# Altium project MB1397.PrjPcb (part 2 of 9)

## Sheet Audio.SchDoc: Audio
size A4; Date: Not used; ApprovedBy: Not used; CheckedBy: Not used; Author: Not used; CompanyName: STMicroelectronics; DrawnBy: Not used; Engineer: Not used; Organization: Not used; Address1: Not used; Address2: Not used; Address3: Not used; Address4: Not used; DocumentNumber: Not used; Revision: Not used; SheetNumber: 9; SheetTotal: 22; CurrentTime: Not used; CurrentDate: Not used; Time: Not used; DocumentFullPathAndName: Not used; DocumentName: Not used; ModifiedDate: Not used; ImagePath: Not used; ProjectName: Not used; Application_BuildNumber: Not used
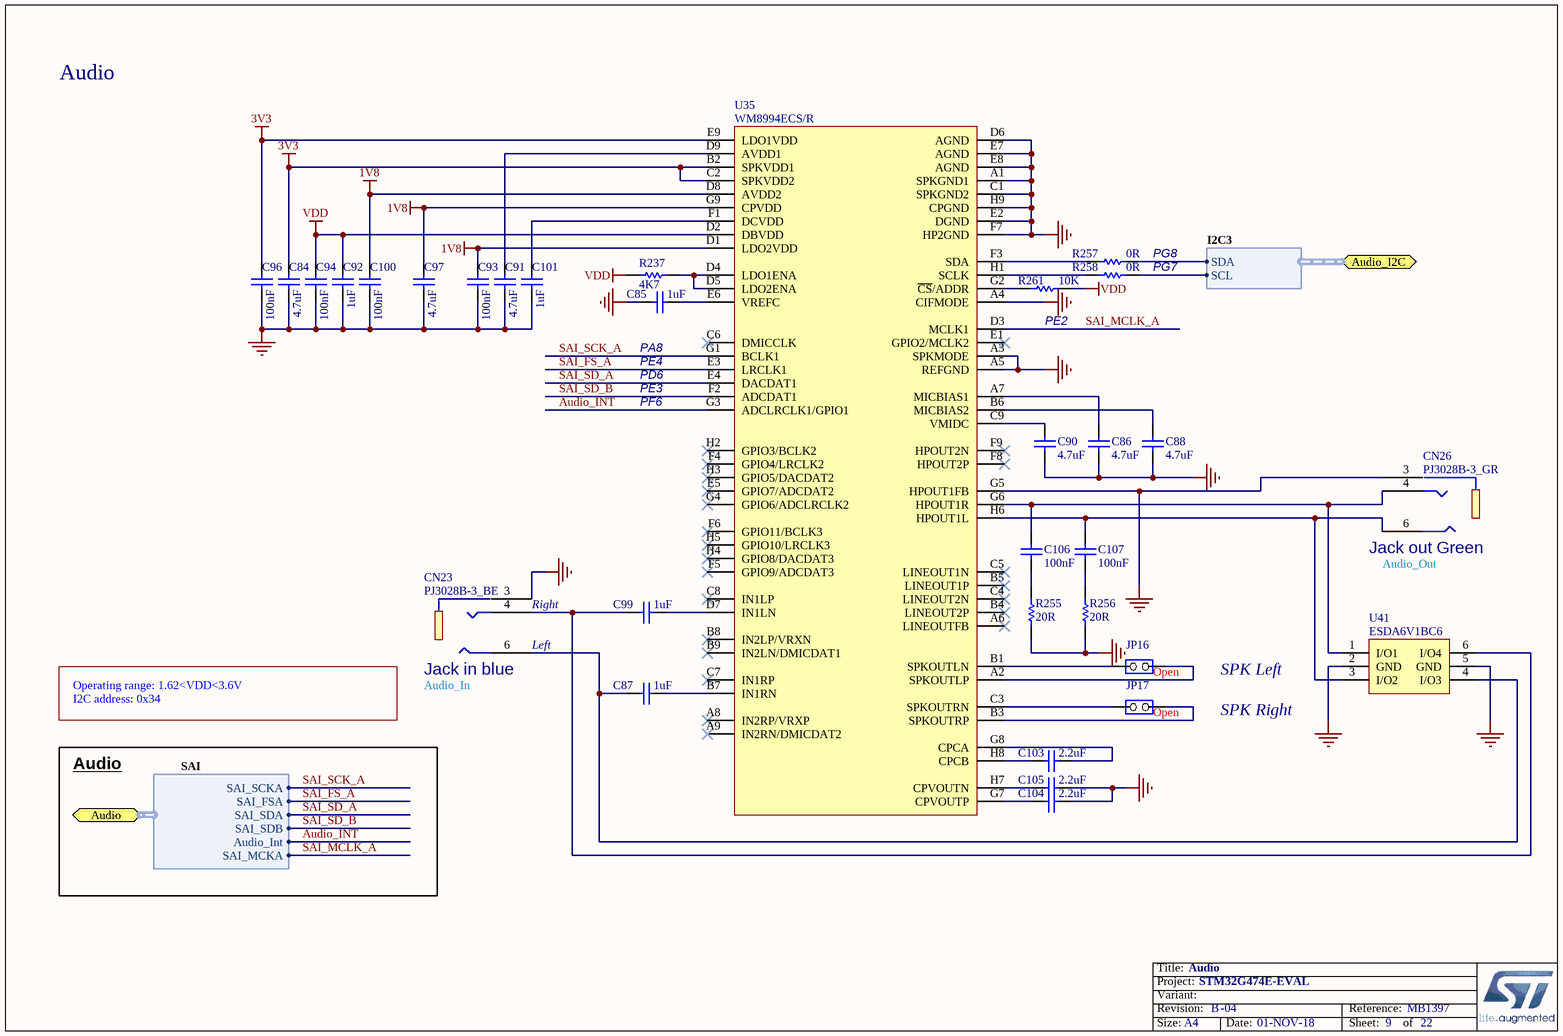
[diagram p4: Audio.SchDoc]

### Parts
C84  value 4.7uF  [C0603]  (hidden comment: Capacitor)
C85  value 1uF  [C0603]  (hidden comment: Capacitor)
C86  value 4.7uF  [C0603]  (hidden comment: Capacitor)
C87  value 1uF  [C0603]  (hidden comment: Capacitor)
C88  value 4.7uF  [C0603]  (hidden comment: Capacitor)
C90  value 4.7uF  [C0603]  (hidden comment: Capacitor)
C91  value 4.7uF  [C0603]  (hidden comment: Capacitor)
C92  value 1uF  [C0603]  (hidden comment: Capacitor)
C93  value 100nF  [C0402]  (hidden comment: Capacitor)
C94  value 100nF  [C0402]  (hidden comment: Capacitor)
C96  value 100nF  [C0402]  (hidden comment: Capacitor)
C97  value 4.7uF  [C0603]  (hidden comment: Capacitor)
C99  value 1uF  [C0603]  (hidden comment: Capacitor)
C100  value 100nF  [C0402]  (hidden comment: Capacitor)
C101  value 1uF  [C0603]  (hidden comment: Capacitor)
C103  value 2.2uF  [C0603]  (hidden comment: Capacitor)
C104  value 2.2uF  [C0603]  (hidden comment: Capacitor)
C105  value 2.2uF  [C0603]  (hidden comment: Capacitor)
C106  value 100nF  [C0402]  (hidden comment: Capacitor)
C107  value 100nF  [C0402]  (hidden comment: Capacitor)
CN23  value PJ3028B-3_BE  [CON_PHONE-JACK-3P5_HY_PJ3028B]  (hidden comment: Jack_PJ3028B-3_3P)
CN26  value PJ3028B-3_GR  [CON_PHONE-JACK-3P5_HY_PJ3028B]  (hidden comment: Jack_PJ3028B-3_3P)
JP16  Jumper_Header 2x1  [CON_SAMTEC_TSW-102-07-G-S]  (value not drawn)
JP17  Jumper_Header 2x1  [CON_SAMTEC_TSW-102-07-G-S]  (value not drawn)
R237  value 4K7  [R0402]  (hidden comment: Resistor)
R255  value 20R  [R0603]  (hidden comment: Resistor)
R256  value 20R  [R0603]  (hidden comment: Resistor)
R257  value 0R  [R0603]  (hidden comment: Resistor)
R258  value 0R  [R0603]  (hidden comment: Resistor)
R261  value 10K  [R0402]  (hidden comment: Resistor)
U35  WM8994ECS/R  [ICC_W-CSP-BGA72_4P511X4P023_P050]
U41  ESDA6V1BC6  [ESD_SOT23-6L]

### Ports
Audio (harness SAI), Audio_I2C (harness I2C3)

### Harnesses
I2C3: SDA, SCL
SAI: SAI_SDB, SAI_FSA, Audio_Int, SAI_SDA, SAI_SCKA, SAI_MCKA

### Nets
1V8: C93.1 C97.2 C100.1 U35.D1(LDO2VDD) U35.D8(AVDD2) U35.G9(CPVDD)
3V3: C84.2 C96.1 U35.B2(SPKVDD1) U35.C2(SPKVDD2) U35.E9(LDO1VDD)
GND: C84.1 C85.2 C86.1 C88.1 C90.1 C91.1 C92.1 C93.2 C94.2 C96.2 C97.1 C100.2 C101.1 C104.1 C105.1 CN23.3 CN26.3 R255.1 R256.1 U35.A1(SPKGND1) U35.A3(SPKMODE) U35.A4(CIFMODE) U35.A5(REFGND) U35.C1(SPKGND2) U35.D6(AGND) U35.E2(DGND) U35.E7(AGND) U35.E8(AGND) U35.F7(HP2GND) U35.G5(HPOUT1FB) U35.H9(CPGND) U41.2(GND) U41.5(GND)
VDD: C92.2 C94.1 R237.1 R261.1 U35.D2(DBVDD)
Audio_INT: U35.G3(ADCLRCLK1/GPIO1) ; port Audio.Audio_Int
SAI_FS_A: U35.E3(LRCLK1) ; port Audio.SAI_FSA
SAI_MCLK_A: U35.D3(MCLK1) ; port Audio.SAI_MCKA
SAI_SCK_A: U35.G1(BCLK1) ; port Audio.SAI_SCKA
SAI_SD_A: U35.E4(DACDAT1) ; port Audio.SAI_SDA
SAI_SD_B: U35.F2(ADCDAT1) ; port Audio.SAI_SDB
NetC85_1: C85.1 U35.E6(VREFC)
NetC86_2: C86.2 U35.A7(MICBIAS1)
NetC87_1: C87.1 U35.B7(IN1RN)
NetC87_2: C87.2 CN23.6 U41.4(I/O3)
NetC88_2: C88.2 U35.B6(MICBIAS2)
NetC90_2: C90.2 U35.C9(VMIDC)
NetC91_2: C91.2 U35.D9(AVDD1)
NetC99_1: C99.1 U35.D7(IN1LN)
NetC99_2: C99.2 CN23.4 U41.6(I/O4)
NetC101_2: C101.2 U35.F1(DCVDD)
NetC103_1: C103.1 U35.G8(CPCA)
NetC103_2: C103.2 U35.H8(CPCB)
NetC104_2: C104.2 U35.G7(CPVOUTP)
NetC105_2: C105.2 U35.H7(CPVOUTN)
NetC106_1: C106.1 CN26.4 U35.G6(HPOUT1R) U41.1(I/O1)
NetC106_2: C106.2 R255.2
NetC107_1: C107.1 CN26.6 U35.H6(HPOUT1L) U41.3(I/O2)
NetC107_2: C107.2 R256.2
NetJP16_1: JP16.1(COMMON) U35.A2(SPKOUTLP)
NetJP16_2: JP16.2(NO) U35.B1(SPKOUTLN)
NetJP17_1: JP17.1(COMMON) U35.B3(SPKOUTRP)
NetJP17_2: JP17.2(NO) U35.C3(SPKOUTRN)
NetR237_2: R237.2 U35.D4(LDO1ENA) U35.D5(LDO2ENA)
NetR257_1: R257.1 U35.F3(SDA)
NetR257_2: R257.2 ; port Audio_I2C.SDA
NetR258_1: R258.1 U35.H1(SCLK)
NetR258_2: R258.2 ; port Audio_I2C.SCL
NetR261_2: R261.2 U35.G2(~{CS}/ADDR)

Not connected (* = marked no-connect by the designer): U35 A6(LINEOUTFB)* A8(IN2RP/VRXP)* A9(IN2RN/DMICDAT2)* B4(LINEOUT2P)* B5(LINEOUT1P)* B8(IN2LP/VRXN)* B9(IN2LN/DMICDAT1)* C4(LINEOUT2N)* C5(LINEOUT1N)* C6(DMICCLK)* C7(IN1RP)* C8(IN1LP)* E1(GPIO2/MCLK2)* E5(GPIO7/ADCDAT2)* F4(GPIO4/LRCLK2)* F5(GPIO9/ADCDAT3)* F6(GPIO11/BCLK3)* F8(HPOUT2P)* F9(HPOUT2N)* G4(GPIO6/ADCLRCLK2)* H2(GPIO3/BCLK2)* H3(GPIO5/DACDAT2)* H4(GPIO8/DACDAT3)* H5(GPIO10/LRCLK3)*

### Notes on the sheet
- Audio
- PG8
- PG7
- (near C85) PA8
- PD6
- PE4
- (near R261) PE2
- PE3
- PF6
- (near CN26) Jack out Green
- (near CN26) Audio_Out
- (near CN23) Right
- (near CN23) Left
- Operating range: 1.62<VDD<3.6V
- I2C address: 0x34
- (near CN23) Jack in blue
- (near CN23) Audio_In
- (near JP16) Open
- (near JP17) Open
- SPK Left
- SPK Right
- Title:
- Project:
- Size:
- Revision:
- Variant:
- A4
- -
- Date:
- Reference:
- Sheet:
- of

### Library data of the parts
C84 C86 C88 C90 C91 C97 = MCD-00009: Capacitor, MLCC, 4.7uF, 16V, X5R, 10%, 0603, T=0.8mm; Manufacturer_Part_Number: CC0603KRX5R7BB475; Manufacturer: YAGEO; Provided_By: SUBCO; Initial_Board_Reference: MB1274; Path: ws/MCD_ApplicationBoards/Lists/MCDPARTSdatabase; Item Type: Item; Internal_Part_Number: MCD-00009; Status: Released; Part_Type: Capacitor; Package: C0603; ComponentLink1Description: Datasheet; ComponentLink1URL: http://tunmcdsvn.tun.st.com/Component_Datasheet_Library/Trunk/Capacitors/Yageo_Multilayer_capacitor_X5R_series_100pF_to_100uF
C85 C87 C92 C99 C101 = MCD-00010: Capacitor, MLCC, 1uF, 16V, X5R, 10%, 0603, T=0,8mm; Manufacturer_Part_Number: CC0603KRX5R7BB105; Manufacturer: YAGEO; Provided_By: SUBCO; Initial_Board_Reference: MB1274; Path: ws/MCD_ApplicationBoards/Lists/MCDPARTSdatabase; Item Type: Item; Internal_Part_Number: MCD-00010; Status: Released; Part_Type: Capacitor; Package: C0603; ComponentLink1Description: Datasheet; ComponentLink1URL: http://tunmcdsvn.tun.st.com/Component_Datasheet_Library/Trunk/Capacitors/Yageo_Multilayer_capacitor_X5R_series_100pF_to_100uF
C93 C94 C96 C100 C106 C107 = MCD-00006: Capacitor, MLCC, 100nF, 16V, X7R, 10%, 0402, T=0.5mm; Manufacturer_Part_Number: CC0402KRX7R7BB104; Manufacturer: YAGEO; Alternate_Manufacturer_Part_Number: GCM155R71C104KA55D; Alternate_Manufacturer: MURATA; Provided_By: SUBCO; Initial_Board_Reference: MB1274; Path: ws/MCD_ApplicationBoards/Lists/MCDPARTSdatabase; Item Type: Item; Internal_Part_Number: MCD-00006; Status: Released; Part_Type: Capacitor; Package: C0402; ComponentLink1Description: Datasheet; ComponentLink1URL: http://tunmcdsvn.tun.st.com/Component_Datasheet_Library/Trunk/Capacitors/Yageo_Multilayer_Capacitor_X7R_series_100pF_to_22uF
C103-C105 = MCD-00012: Capacitor, MLCC, 2.2uF, 10V, X5R, 10%, 0603, T=0,8mm; Manufacturer_Part_Number: CC0603KRX5R6BB225; Manufacturer: YAGEO; Alternate_Manufacturer_Part_Number: C0603C225K8PACTU; Alternate_Manufacturer: KEMET; Provided_By: SUBCO; Initial_Board_Reference: MB1274; Path: ws/MCD_ApplicationBoards/Lists/MCDPARTSdatabase; Item Type: Item; Internal_Part_Number: MCD-00012; Status: Released; Part_Type: Capacitor; Package: C0603; ComponentLink1Description: Datasheet; ComponentLink1URL: http://tunmcdsvn.tun.st.com/Component_Datasheet_Library/Trunk/Capacitors/Yageo_Multilayer_capacitor_X5R_series_100pF_to_100uF
CN23 = MCD-00682: Connector Jack socket Stereo 3.5mm, 3 pins, RA, SMT, Blue (Line input); Manufacturer: QIAOD; Alternate_Manufacturer_Part_Number: PJ30280-3_BE; Provided_By: SUBCO; Initial_Board_Reference: MB1260; Path: ws/MCD_ApplicationBoards/Lists/MCDPARTSdatabase; Item Type: Item; Internal_Part_Number: MCD-00682; Status: Footprint available; Part_Type: Connector; Manufacturer_Part_Number: PJ3028B-3_BE; Alternate_Manufacturer: QIAOD; ComponentLink1Description: Datasheet; ComponentLink1URL: http://tunmcdsvn.tun.st.com/Component_Datasheet_Library/Trunk/Connectors/QIAOD_PJ-3028B-3-XX
CN26 = MCD-00018: Connector Jack socket Stereo 3.5mm, 3 pins, RA, SMT, Green (Line output); Manufacturer: QIAOD; Alternate_Manufacturer_Part_Number: PJ30280-3_GR; Provided_By: SUBCO; Initial_Board_Reference: MB1274; Path: ws/MCD_ApplicationBoards/Lists/MCDPARTSdatabase; Item Type: Item; Internal_Part_Number: MCD-00018; Status: Released; Part_Type: Connector; Manufacturer_Part_Number: PJ3028B-3_GR; Alternate_Manufacturer: QIAOD; ComponentLink1Description: Datasheet; ComponentLink1URL: http://tunmcdsvn.tun.st.com/Component_Datasheet_Library/Trunk/Connectors/QIAOD_PJ-3028B-3-XX
JP16 JP17 = MCD-00045: Header, 2x1, 2,54mm, VR, TH, Height 5.84mm/2.54mm; Part_Type: Connector; Manufacturer_Part_Number: TSW-102-07-x-S; Manufacturer: SAMTEC; Value: Shunt not fitted; Provided_By: SUBCO; Initial_Board_Reference: MB1274; Path: ws/MCD_ApplicationBoards/Lists/MCDPARTSdatabase; Item Type: Item; Internal_Part_Number: MCD-00045; Status: Released; ComponentLink1Description: Datasheet; ComponentLink1URL: http://tunmcdsvn.tun.st.com/Component_Datasheet_Library/Trunk/Connectors/Samtec_TSW-HTSW-series
R237 = MCD-00065: Resistor,4K7,0402,1%,1/16W; Manufacturer_Part_Number: RC0402FR-074K7L; Manufacturer: YAGEO; Alternate_Manufacturer_Part_Number: RT0402FRE074K7L; Provided_By: SUBCO; Initial_Board_Reference: MB1274; Path: ws/MCD_ApplicationBoards/Lists/MCDPARTSdatabase; Item Type: Item; Internal_Part_Number: MCD-00065; Status: Released; Part_Type: Resistor; Package: R0402; ComponentLink1Description: Datasheet; ComponentLink1URL: http://tunmcdsvn.tun.st.com/Component_Datasheet_Library/Trunk/Resistors/Yageo_Resistor_RC0402-series; Alternate_Manufacturer: YAGEO
R255 R256 = MCD-00345: Resistor,20R,0603,1%,1/10W; Manufacturer_Part_Number: RC0603FR-0720RL; Manufacturer: YAGEO; Provided_By: SUBCO; Initial_Board_Reference: MBxxxx; Path: ws/MCD_ApplicationBoards/Lists/MCDPARTSdatabase; Item Type: Item; Internal_Part_Number: MCD-00345; Status: Released; Part_Type: Resistor; Package: R0603; ComponentLink1Description: Datasheet; ComponentLink1URL: http://tunmcdsvn.tun.st.com/Component_Datasheet_Library/Trunk/Resistors/Yageo_Resistor_RC0603-series
R257 R258 = MCD-00056: Resistor,0R,0603,5%,1/10W; Manufacturer_Part_Number: RC0603JR-070RL; Manufacturer: YAGEO; Provided_By: SUBCO; Initial_Board_Reference: MB1274; Path: ws/MCD_ApplicationBoards/Lists/MCDPARTSdatabase; Item Type: Item; Internal_Part_Number: MCD-00056; Status: Released; Part_Type: Resistor; Package: R0603; ComponentLink1Description: Datasheet; ComponentLink1URL: http://tunmcdsvn.tun.st.com/Component_Datasheet_Library/Trunk/Resistors/Yageo_Resistor_RC0603-series
R261 = MCD-00053: Resistor,10K,0402,1%,1/16W; Manufacturer_Part_Number: RC0402FR-0710KL; Manufacturer: YAGEO; Provided_By: SUBCO; Initial_Board_Reference: MB1274; Path: ws/MCD_ApplicationBoards/Lists/MCDPARTSdatabase; Item Type: Item; Internal_Part_Number: MCD-00053; Status: Released; Part_Type: Resistor; Package: R0402; ComponentLink1Description: Datasheet; ComponentLink1URL: http://tunmcdsvn.tun.st.com/Component_Datasheet_Library/Trunk/Resistors/Yageo_Resistor_RC0402-series
U35 = MCD-00079: Multi-Channel Audio Hub CODEC for Smartphones; Part_Type: IC; Manufacturer: CIRRUS LOGIC; Provided_By: SUBCO; Initial_Board_Reference: MB1274; Path: ws/MCD_ApplicationBoards/Lists/MCDPARTSdatabase; Item Type: Item; Internal_Part_Number: MCD-00079; Value: WM8994ECS/R; Status: Released; Manufacturer_Part_Number: WM8994ECS/R; ComponentLink1Description: Datasheet; ComponentLink1URL: http://tunmcdsvn.tun.st.com/Component_Datasheet_Library/Trunk/IC/Wolfson_AudioCodec_WM8994
U41 = MCD-00247: Quad Bidir ESD protection; Part_Type: Diode; Manufacturer: STMICROELECTRONICS; BMS_Part_Number: 9179038; Provided_By: SUBCO with ST control; Initial_Board_Reference: MB1311; Path: ws/MCD_ApplicationBoards/Lists/MCDPARTSdatabase; Item Type: Item; Internal_Part_Number: MCD-00247; Value: ESDA6V1BC6; Status: Released; Manufacturer_Part_Number: ESDA6V1BC6; ComponentLink1Description: Datasheet; ComponentLink1URL: http://tunmcdsvn.tun.st.com/Component_Datasheet_Library/Trunk/Diodes/STM_ESD_ESDA6V1BC6

## Sheet QSPI Memory.SchDoc: QSPI Memory
size A4; Date: Not used; ApprovedBy: Not used; CheckedBy: Not used; Author: Not used; CompanyName: STMicroelectronics; DrawnBy: Not used; Engineer: Not used; Organization: Not used; Address1: Not used; Address2: Not used; Address3: Not used; Address4: Not used; DocumentNumber: Not used; Revision: Not used; SheetNumber: 8; SheetTotal: 22; CurrentTime: Not used; CurrentDate: Not used; Time: Not used; DocumentFullPathAndName: Not used; DocumentName: Not used; ModifiedDate: Not used; ImagePath: Not used; ProjectName: Not used; Application_BuildNumber: Not used
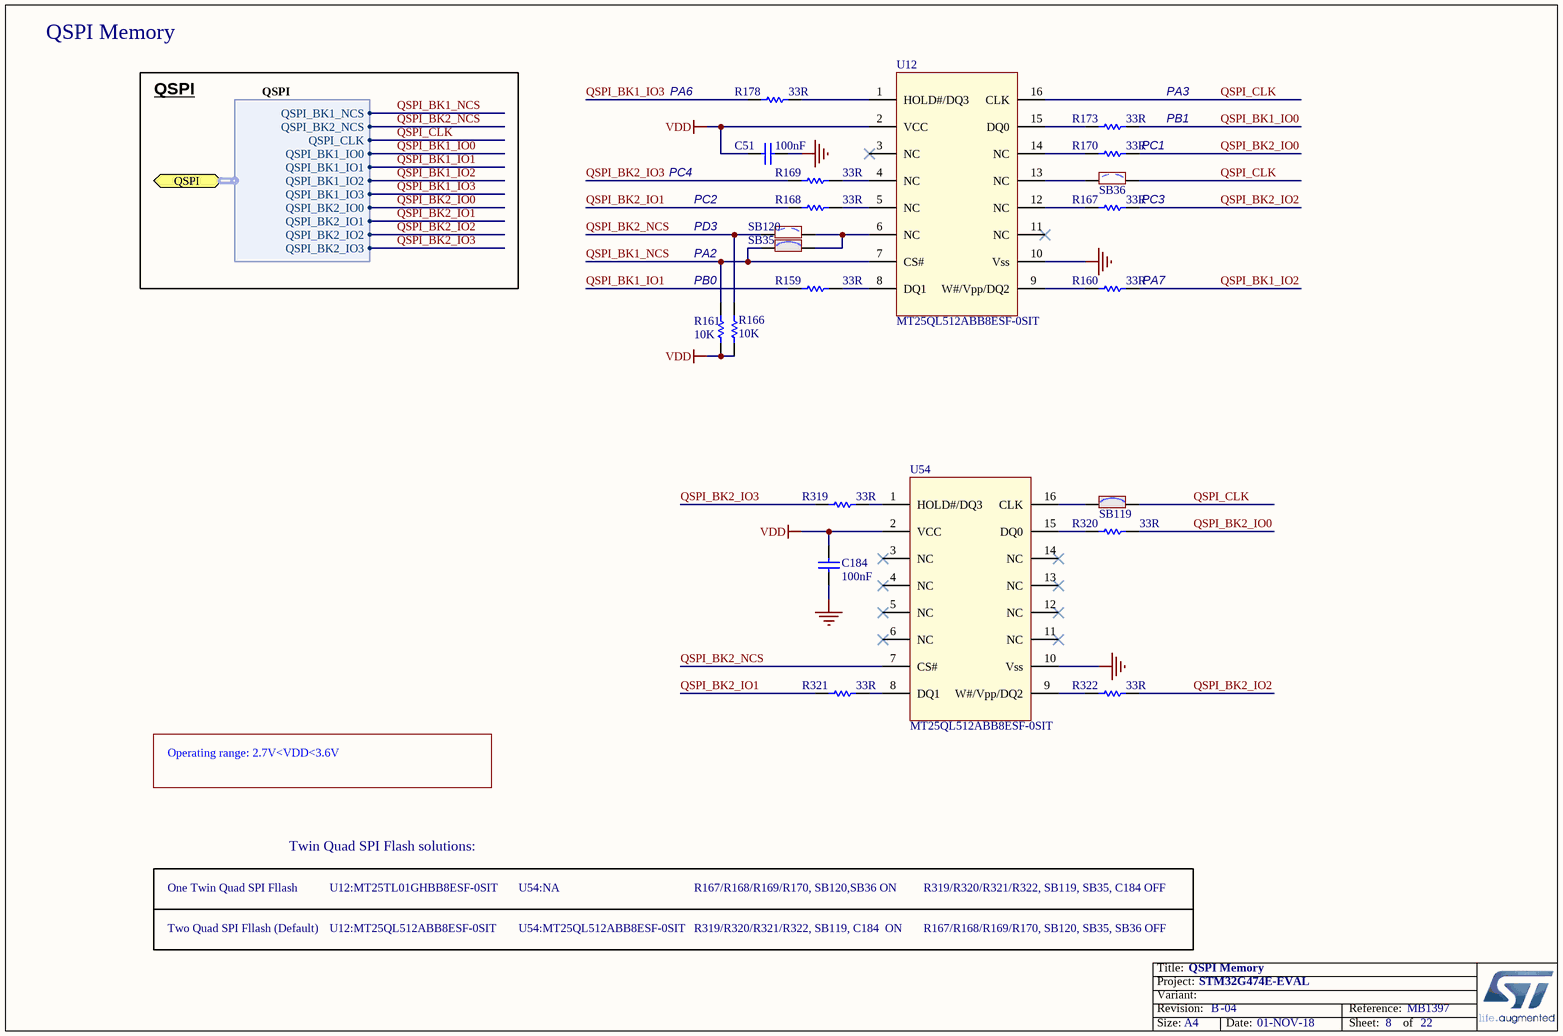
[diagram p5: QSPI Memory.SchDoc]

### Parts
C51  value 100nF  [C0402]  (hidden comment: Capacitor)
C184  value 100nF  [C0402]  (hidden comment: Capacitor)
R159  value 33R  [R0402]  (hidden comment: Resistor)
R160  value 33R  [R0402]  (hidden comment: Resistor)
R161  value 10K  [R0402]  (hidden comment: Resistor)
R166  value 10K  [R0402]  (hidden comment: Resistor)
R167  value 33R  [R0402]  (hidden comment: Resistor)
R168  value 33R  [R0402]  (hidden comment: Resistor)
R169  value 33R  [R0402]  (hidden comment: Resistor)
R170  value 33R  [R0402]  (hidden comment: Resistor)
R173  value 33R  [R0402]  (hidden comment: Resistor)
R178  value 33R  [R0402]  (hidden comment: Resistor)
R319  value 33R  [R0402]  (hidden comment: Resistor)
R320  value 33R  [R0402]  (hidden comment: Resistor)
R321  value 33R  [R0402]  (hidden comment: Resistor)
R322  value 33R  [R0402]  (hidden comment: Resistor)
SB35  SB_ON  [SOLDER-BRIDGE_R0603-0R]  (value not drawn)
SB36  SB_OFF  [SOLDER-BRIDGE_R0603-0R]  (value not drawn)
SB119  SB_ON  [SOLDER-BRIDGE_R0603-0R]  (value not drawn)
SB120  SB_OFF  [SOLDER-BRIDGE_R0603-0R]  (value not drawn)
U12  MT25QL512ABB8ESF-0SIT  [ICC_SOP2-SF_16P_10P3X7P5_P127]
U54  MT25QL512ABB8ESF-0SIT  [ICC_SOP2-SF_16P_10P3X7P5_P127]

### Ports
QSPI (harness QSPI)

### Harnesses
QSPI: QSPI_BK1_IO1, QSPI_BK1_IO0, QSPI_CLK, QSPI_BK1_NCS, QSPI_BK1_IO2, QSPI_BK1_IO3, QSPI_BK2_IO1, QSPI_BK2_IO0, QSPI_BK2_IO2, QSPI_BK2_IO3, QSPI_BK2_NCS

### Nets
GND: C51.1 C184.1 U12.10(Vss) U54.10(Vss)
VDD: C51.2 C184.2 R161.1 R166.1 U12.2(VCC) U54.2(VCC)
QSPI_BK1_IO0: R173.2 ; port QSPI.QSPI_BK1_IO0
QSPI_BK1_IO1: R159.1 ; port QSPI.QSPI_BK1_IO1
QSPI_BK1_IO2: R160.2 ; port QSPI.QSPI_BK1_IO2
QSPI_BK1_IO3: R178.1 ; port QSPI.QSPI_BK1_IO3
QSPI_BK1_NCS: R161.2 SB35.1 U12.7(CS#) ; port QSPI.QSPI_BK1_NCS
QSPI_BK2_IO0: R170.2 R320.2 ; port QSPI.QSPI_BK2_IO0
QSPI_BK2_IO1: R168.1 R321.1 ; port QSPI.QSPI_BK2_IO1
QSPI_BK2_IO2: R167.2 R322.2 ; port QSPI.QSPI_BK2_IO2
QSPI_BK2_IO3: R169.1 R319.1 ; port QSPI.QSPI_BK2_IO3
QSPI_BK2_NCS: R166.2 SB120.1 U54.7(CS#) ; port QSPI.QSPI_BK2_NCS
QSPI_CLK: SB36.2 SB119.2 U12.16(CLK) ; port QSPI.QSPI_CLK
NetR159_2: R159.2 U12.8(DQ1)
NetR160_1: R160.1 U12.9(W#/Vpp/DQ2)
NetR167_1: R167.1 U12.12(NC)
NetR168_2: R168.2 U12.5(NC)
NetR169_2: R169.2 U12.4(NC)
NetR170_1: R170.1 U12.14(NC)
NetR173_1: R173.1 U12.15(DQ0)
NetR178_2: R178.2 U12.1(HOLD#/DQ3)
NetR319_2: R319.2 U54.1(HOLD#/DQ3)
NetR320_1: R320.1 U54.15(DQ0)
NetR321_2: R321.2 U54.8(DQ1)
NetR322_1: R322.1 U54.9(W#/Vpp/DQ2)
NetSB35_2: SB35.2 SB120.2 U12.6(NC)
NetSB36_1: SB36.1 U12.13(NC)
NetSB119_1: SB119.1 U54.16(CLK)

Not connected (* = marked no-connect by the designer): U12 3(NC)* 11(NC)*; U54 3(NC)* 4(NC)* 5(NC)* 6(NC)* 11(NC)* 12(NC)* 13(NC)* 14(NC)*

### Notes on the sheet
- QSPI Memory
- QSPI
- PA6
- PA3
- (near C51) PC4
- PB1
- PC1
- PC2
- PD3
- PC3
- PB0
- PA2
- (near R160) PA7
- Operating range: 2.7V<VDD<3.6V
- Twin Quad SPI Flash solutions:
- One Twin Quad SPI Fllash
- U12:MT25TL01GHBB8ESF-0SIT
- U54:NA
- R167/R168/R169/R170, SB120,SB36 ON
- R319/R320/R321/R322, SB119, SB35, C184 OFF
- Two Quad SPI Fllash (Default)
- U12:MT25QL512ABB8ESF-0SIT
- U54:MT25QL512ABB8ESF-0SIT
- R319/R320/R321/R322, SB119, C184  ON
- R167/R168/R169/R170, SB120, SB35, SB36 OFF
- Title:
- Project:
- Size:
- Revision:
- Variant:
- A4
- -
- Date:
- Reference:
- Sheet:
- of

### Library data of the parts
C51 C184 = MCD-00006: as C93 on sheet Audio; Internal_Part_Number: MCD-00006; Status: Released; Part_Type: Capacitor; Package: C0402; ComponentLink1Description: Datasheet; ComponentLink1URL: http://tunmcdsvn.tun.st.com/Component_Datasheet_Library/Trunk/Capacitors/Yageo_Multilayer_Capacitor_X7R_series_100pF_to_22uF
R159 R160 R167-R170 R173 R178 R319-R322 = MCD-00455: Resistor,33R,0402,1%,1/16W; Manufacturer_Part_Number: RC0402FR-0733RL; Manufacturer: YAGEO; Provided_By: SUBCO; Initial_Board_Reference: MBxxxx; Path: ws/MCD_ApplicationBoards/Lists/MCDPARTSdatabase; Item Type: Item; Internal_Part_Number: MCD-00455; Status: Released; Part_Type: Resistor; Package: R0402; ComponentLink1Description: Datasheet; ComponentLink1URL: http://tunmcdsvn.tun.st.com/Component_Datasheet_Library/Trunk/Resistors/Yageo_Resistor_RC0402-series
R161 R166 = MCD-00053: as R261 on sheet Audio; Internal_Part_Number: MCD-00053; Status: Released; Part_Type: Resistor; Package: R0402; ComponentLink1Description: Datasheet; ComponentLink1URL: http://tunmcdsvn.tun.st.com/Component_Datasheet_Library/Trunk/Resistors/Yageo_Resistor_RC0402-series
SB35 SB119 = MCD-00071: Solder Bridge ON; Part_Type: Mechanical; Manufacturer_Part_Number: RC0603JR-070RL; Manufacturer: YAGEO; Provided_By: SUBCO; Initial_Board_Reference: MB1274; Path: ws/MCD_ApplicationBoards/Lists/MCDPARTSdatabase; Item Type: Item; Internal_Part_Number: MCD-00071; Status: Released; ComponentLink1Description: Datasheet; Package: SB0603; ComponentLink1URL: http://tunmcdsvn.tun.st.com/Component_Datasheet_Library/Trunk/Resistors/Yageo_Resistor_RC0603-series
SB36 SB120 = MCD-00072: Solder Bridge OFF; Part_Type: Mechanical; Manufacturer_Part_Number: RC0603JR-070RL; Manufacturer: YAGEO; Provided_By: SUBCO; Initial_Board_Reference: MB1274; Path: ws/MCD_ApplicationBoards/Lists/MCDPARTSdatabase; Item Type: Item; Internal_Part_Number: MCD-00072; Status: Released; ComponentLink1Description: Datasheet; Package: SB0603; ComponentLink1URL: http://tunmcdsvn.tun.st.com/Component_Datasheet_Library/Trunk/Resistors/Yageo_Resistor_RC0603-series
U12 U54 = MCD-01128: Micron Serial NOR Flash Memory; Part_Type: IC; BMS_Part_Number: 9171976; Provided_By: SUBCO; Initial_Board_Reference: MB1381; Path: ws/MCD_ApplicationBoards/Lists/MCDPARTSdatabase; Item Type: Item; Internal_Part_Number: MCD-01128; Value: MT25QL512ABB8ESF-0SIT; Status: Footprint available; Manufacturer_Part_Number: MT25QL512ABB8ESF-0SIT; Manufacturer: MICRON; Package: SOIC16; ComponentLink1Description: Datasheet; ComponentLink1URL: http://tunmcdsvn.tun.st.com/Component_Datasheet_Library/Trunk/IC/Micron_NOR%20Flash_MT25QL512ABA8ESF-0SIT/Micron_NOR%20Flash_MT25QL512ABA8ESF-0SIT.pdf

## Sheet FDCAN.SchDoc: FDCAN
size A4; Date: Not used; ApprovedBy: Not used; CheckedBy: Not used; Author: Not used; CompanyName: STMicroelectronics; DrawnBy: Not used; Engineer: Not used; Organization: Not used; Address1: Not used; Address2: Not used; Address3: Not used; Address4: Not used; DocumentNumber: Not used; Revision: Not used; SheetNumber: 12; SheetTotal: 22; CurrentTime: Not used; CurrentDate: Not used; Time: Not used; DocumentFullPathAndName: Not used; DocumentName: Not used; ModifiedDate: Not used; ImagePath: Not used; ProjectName: Not used; Application_BuildNumber: Not used
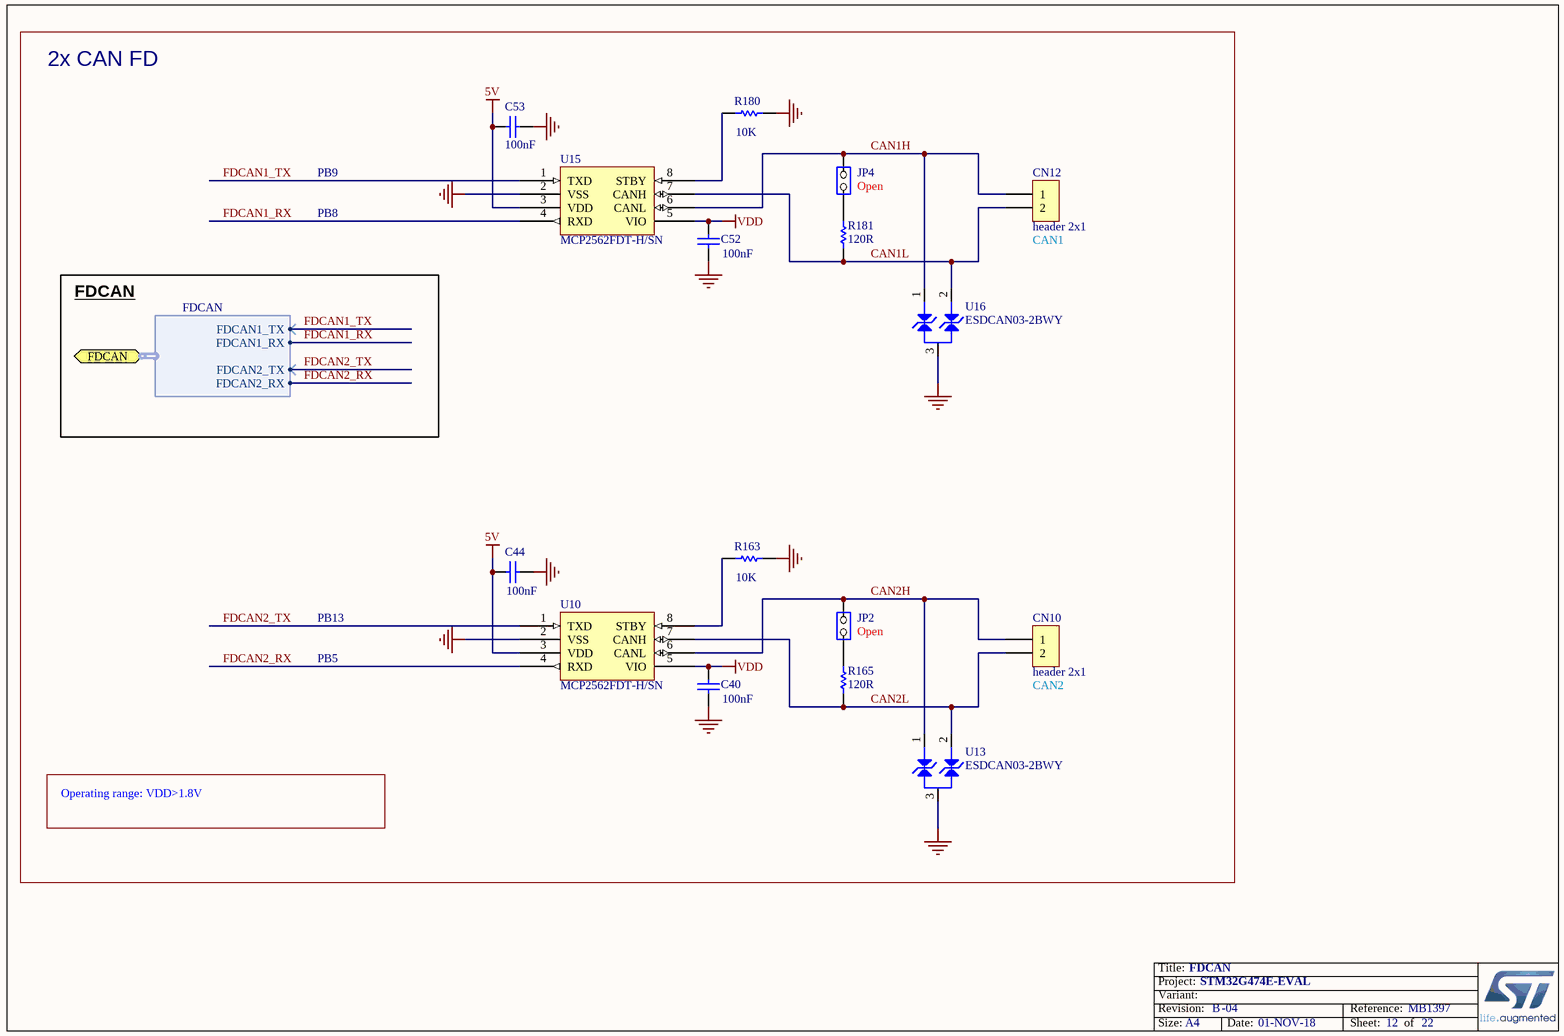
[diagram p6: FDCAN.SchDoc]

### Parts
C40  value 100nF  [C0402]  (hidden comment: Capacitor)
C44  value 100nF  [C0402]  (hidden comment: Capacitor)
C52  value 100nF  [C0402]  (hidden comment: Capacitor)
C53  value 100nF  [C0402]  (hidden comment: Capacitor)
CN10  Header 2x1  [CON_988-JIUBABA_PHFS25-11-02-G0B115-T-1]
CN12  Header 2x1  [CON_988-JIUBABA_PHFS25-11-02-G0B115-T-1]
JP2  Jumper_Header 2x1  [CON_SAMTEC_TSW-102-07-G-S]  (value not drawn)
JP4  Jumper_Header 2x1  [CON_SAMTEC_TSW-102-07-G-S]  (value not drawn)
R163  value 10K  [R0402]  (hidden comment: Resistor)
R165  value 120R  [R0603]  (hidden comment: Resistor)
R180  value 10K  [R0402]  (hidden comment: Resistor)
R181  value 120R  [R0603]  (hidden comment: Resistor)
U10  value MCP2562FDT-H/SN  [ICC_SO8_5X4_P127]  (hidden comment: MCP2562FD)
U13  value ESDCAN03-2BWY  [DIO_SOT323]  (hidden comment: ESD-TRANSIL-DUAL-BIDIR)
U15  value MCP2562FDT-H/SN  [ICC_SO8_5X4_P127]  (hidden comment: MCP2562FD)
U16  value ESDCAN03-2BWY  [DIO_SOT323]  (hidden comment: ESD-TRANSIL-DUAL-BIDIR)

### Ports
FDCAN (harness FDCAN)

### Harnesses
FDCAN: FDCAN1_TX, FDCAN1_RX, FDCAN2_TX, FDCAN2_RX

### Nets
5V: C44.1 C53.1 U10.3(VDD) U15.3(VDD)
GND: C40.2 C44.2 C52.2 C53.2 R163.2 R180.2 U10.2(VSS) U13.3 U15.2(VSS) U16.3
VDD: C40.1 C52.1 U10.5(VIO) U15.5(VIO)
CAN1H: CN12.1 JP4.2(NO) U15.6(CANL) U16.1
CAN1L: CN12.2 R181.1 U15.7(CANH) U16.2
CAN2H: CN10.1 JP2.2(NO) U10.6(CANL) U13.1
CAN2L: CN10.2 R165.1 U10.7(CANH) U13.2
FDCAN1_RX: U15.4(RXD) ; port FDCAN.FDCAN1_RX
FDCAN1_TX: U15.1(TXD) ; port FDCAN.FDCAN1_TX
FDCAN2_RX: U10.4(RXD) ; port FDCAN.FDCAN2_RX
FDCAN2_TX: U10.1(TXD) ; port FDCAN.FDCAN2_TX
NetJP2_1: JP2.1(COMMON) R165.2
NetJP4_1: JP4.1(COMMON) R181.2
NetR163_1: R163.1 U10.8(STBY)
NetR180_1: R180.1 U15.8(STBY)

### Notes on the sheet
- 2x CAN FD
- PB9
- PB8
- (near JP4) Open
- (near CN12) CAN1
- FDCAN
- PB13
- (near JP2) Open
- PB5
- (near CN10) CAN2
- Operating range: VDD>1.8V
- Title:
- Project:
- Size:
- Revision:
- Variant:
- A4
- -
- Date:
- Reference:
- Sheet:
- of

### Library data of the parts
C40 C44 C52 C53 = MCD-00006: as C93 on sheet Audio; Internal_Part_Number: MCD-00006; ComponentLink1Description: Datasheet; Status: Released; Package: C0402; Part_Type: Capacitor; ComponentLink1URL: http://tunmcdsvn.tun.st.com/Component_Datasheet_Library/Trunk/Capacitors/Yageo_Multilayer_Capacitor_X7R_series_100pF_to_22uF
CN10 CN12 = MCD-00314: Header, 2x1, 2.54mm, VR, TH, Height 6mm/3mm; Part_Type: Connector; Manufacturer_Part_Number: PHFS25-11-02-G0B115-T-1; Manufacturer: JIUBABA; Provided_By: SUBCO; Initial_Board_Reference: MB1311; Path: ws/MCD_ApplicationBoards/Lists/MCDPARTSdatabase; Item Type: Item; Internal_Part_Number: MCD-00314; Value: header 2x1; Status: Released; ComponentLink1Description: Datasheet; ComponentLink1URL: http://tunmcdsvn.tun.st.com/Component_Datasheet_Library/Trunk/Connectors/Jiubaba_PHFS25_11XXXXXXXXXX
JP2 JP4 = MCD-00045: Header, 2x1, 2,54mm, VR, TH, Height 5.84mm/2.54mm; Manufacturer_Part_Number: TSW-102-07-x-S; Manufacturer: SAMTEC; Part_Type: Connector; Value: Shunt not fitted; Provided_By: SUBCO; Initial_Board_Reference: MB1274; Path: ws/MCD_ApplicationBoards/Lists/MCDPARTSdatabase; Item Type: Item; Internal_Part_Number: MCD-00045; ComponentLink1Description: Datasheet; Status: Released; ComponentLink1URL: http://tunmcdsvn.tun.st.com/Component_Datasheet_Library/Trunk/Connectors/Samtec_TSW-HTSW-series
R163 R180 = MCD-00053: as R261 on sheet Audio; Internal_Part_Number: MCD-00053; ComponentLink1Description: Datasheet; Status: Released; Part_Type: Resistor; Package: R0402; ComponentLink1URL: http://tunmcdsvn.tun.st.com/Component_Datasheet_Library/Trunk/Resistors/Yageo_Resistor_RC0402-series
R165 R181 = MCD-00338: Resistor,120R,0603,1%,1/10W; Manufacturer_Part_Number: RC0603FR-07120RL; Manufacturer: YAGEO; BMS_Part_Number: 9129734; Provided_By: SUBCO; Initial_Board_Reference: MBxxxx; Path: ws/MCD_ApplicationBoards/Lists/MCDPARTSdatabase; Item Type: Item; Internal_Part_Number: MCD-00338; Status: Released; ComponentLink1Description: Datasheet; Part_Type: Resistor; Package: R0603; ComponentLink1URL: http://tunmcdsvn.tun.st.com/Component_Datasheet_Library/Trunk/Resistors/Yageo_Resistor_RC0603-series
U10 U15 = MCD-00129: High-Speed CAN Flexible Data Rate Transceiver; Manufacturer: MICROCHIP; Part_Type: IC; Provided_By: SUBCO; Initial_Board_Reference: MB1262; Path: ws/MCD_ApplicationBoards/Lists/MCDPARTSdatabase; Item Type: Item; Internal_Part_Number: MCD-00129; Manufacturer_Part_Number: MCP2562FDT-H/SN; ComponentLink1Description: Datasheet; Status: Released; ComponentLink1URL: http://tunmcdsvn.tun.st.com/Component_Datasheet_Library/Trunk/IC/Microchip_CAN Transceiver_MCP2562FD
U13 U16 = MCD-01228: Automotive dual-line Transil, transient voltage suppressor (TVS) for CAN bus. Compliant with interfaces in automotive: CAN-FD, LIN, FlexRay, MOST, SENT, USB; Part_Type: Diode; Manufacturer: STMICROELECTRONICS; Provided_By: SUBCO with ST control; Initial_Board_Reference: MB1397; Path: ws/MCD_ApplicationBoards/Lists/MCDPARTSdatabase; Item Type: Item; Internal_Part_Number: MCD-01228; Status: Checked; Manufacturer_Part_Number: ESDCAN03-2BWY; Package: SOT323-3L; ComponentLink1Description: Datasheet; ComponentLink1URL: http://tunmcdsvn.tun.st.com/Component_Datasheet_Library/Trunk/Diodes/STM_ESD_ESDCAN02-2BWY

## Sheet LCD&SDcard.SchDoc: LCD & SD Card
size A4; Date: Not used; ApprovedBy: Not used; CheckedBy: Not used; Author: Not used; CompanyName: STMicroelectronics; DrawnBy: Not used; Engineer: Not used; Organization: Not used; Address1: Not used; Address2: Not used; Address3: Not used; Address4: Not used; DocumentNumber: Not used; Revision: Not used; SheetNumber: 10; SheetTotal: 22; CurrentTime: Not used; CurrentDate: Not used; Time: Not used; DocumentFullPathAndName: Not used; DocumentName: Not used; ModifiedDate: Not used; ImagePath: Not used; ProjectName: Not used; Application_BuildNumber: Not used
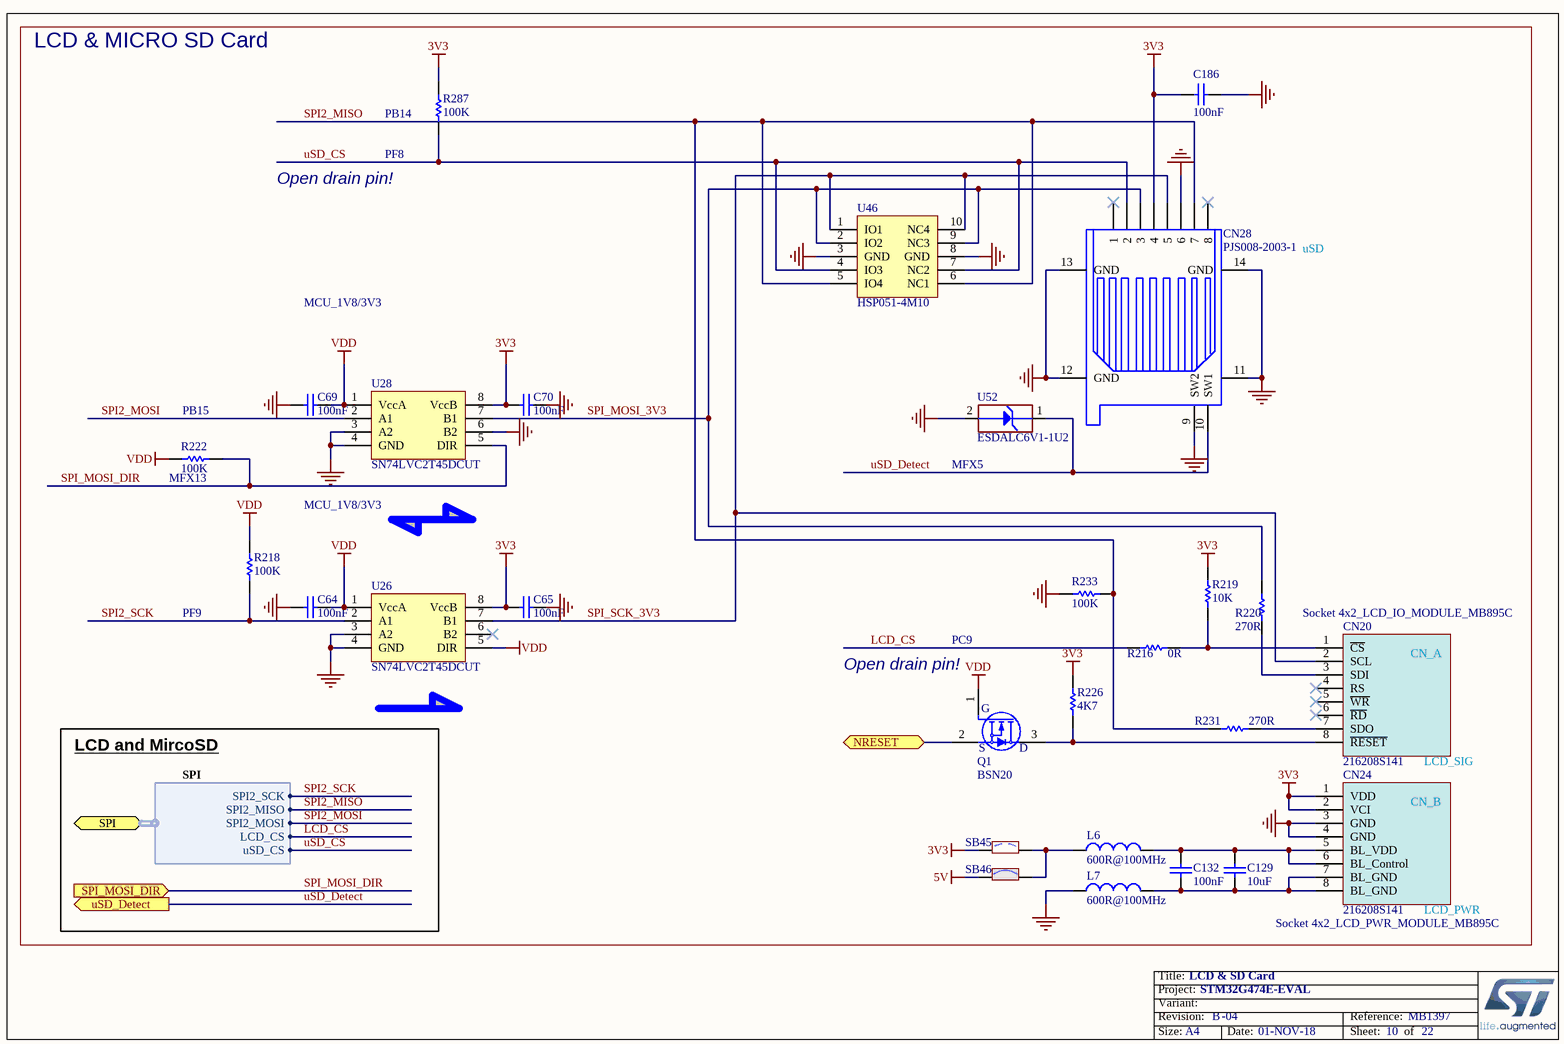
[diagram p7: LCD&SDcard.SchDoc]

### Parts
C64  value 100nF  [C0603]  (hidden comment: Capacitor)
C65  value 100nF  [C0603]  (hidden comment: Capacitor)
C69  value 100nF  [C0603]  (hidden comment: Capacitor)
C70  value 100nF  [C0603]  (hidden comment: Capacitor)
C129  value 10uF  [C0805]  (hidden comment: Capacitor)
C132  value 100nF  [C0402]  (hidden comment: Capacitor)
C186  value 100nF  [C0402]  (hidden comment: Capacitor)
CN20  Socket 4x2_LCD_IO_MODULE_MB895C  value 216208S141  [CON_SOCKET-LCD_LYCN_216208S141]
CN24  Socket 4x2_LCD_PWR_MODULE_MB895C  value 216208S141  [CON_SOCKET-LCD_LYCN_216208S141]
CN28  value PJS008-2003-1  [CON_MICROSD_YAMAICHI_PJS008-2003-1]  (hidden comment: microSD-PJS008-2003)
L6  value 600R@100MHz  [L0603]  (hidden comment: BEAD)
L7  value 600R@100MHz  [L0603]  (hidden comment: BEAD)
Q1  BSN20  [MOS_SOT23]
R216  value 0R  [R0603]  (hidden comment: Resistor)
R218  value 100K  [R0603]  (hidden comment: Resistor)
R219  value 10K  [R0603]  (hidden comment: Resistor)
R220  value 270R  [R0603]  (hidden comment: Resistor)
R222  value 100K  [R0603]  (hidden comment: Resistor)
R226  value 4K7  [R0402]  (hidden comment: Resistor)
R231  value 270R  [R0603]  (hidden comment: Resistor)
R233  value 100K  [R0603]  (hidden comment: Resistor)
R287  value 100K  [R0603]  (hidden comment: Resistor)
SB45  SB_OFF  [SOLDER-BRIDGE_R0603-0R]  (value not drawn)
SB46  SB_ON  [SOLDER-BRIDGE_R0603-0R]  (value not drawn)
U26  SN74LVC2T45DCUT  [ICC_VSSOP8_DCU_R-PDSO-G8_2X2P30_P050]
U28  SN74LVC2T45DCUT  [ICC_VSSOP8_DCU_R-PDSO-G8_2X2P30_P050]
U46  HSP051-4M10  [ESD_UQFN-10L_2P5X1_P050]
U52  value ESDALC6V1-1U2  [ESD_ST0201]  (hidden comment: ESD-TRANSIL)

### Ports
NRESET, SPI (harness SPI), SPI_MOSI_DIR (in), uSD_Detect (out)

### Harnesses
SPI: SPI2_SCK, SPI2_MISO, SPI2_MOSI, LCD_CS, uSD_CS

### Nets
3V3: C65.2 C70.2 C186.1 CN24.1(VDD) CN24.2(VCI) CN28.4 R219.2 R226.1 R287.2 SB45.1 U26.8(VccB) U28.8(VccB)
5V: SB46.1
GND: C64.2 C65.1 C69.2 C70.1 C186.2 CN24.3(GND) CN24.4(GND) CN28.6 CN28.9(SW2) CN28.11(GND) CN28.12(GND) CN28.13(GND) CN28.14(GND) L7.1 R233.2 U26.3(A2) U26.4(GND) U28.3(A2) U28.4(GND) U28.6(B2) U46.3(GND) U46.8(GND) U52.2(GND)
VDD: C64.1 C69.1 Q1.1(G) R218.2 R222.2 U26.1(VccA) U26.5(DIR) U28.1(VccA)
LCD_CS: R216.1 ; port SPI.LCD_CS
SPI2_MISO: CN28.7 R231.1 R233.1 U46.5(IO4) U46.6(NC1) ; port SPI.SPI2_MISO
SPI2_MOSI: U28.2(A1) ; port SPI.SPI2_MOSI
SPI2_SCK: R218.1 U26.2(A1) ; port SPI.SPI2_SCK
SPI_MOSI_3V3: CN28.3 R220.1 U28.7(B1) U46.2(IO2) U46.9(NC3)
SPI_MOSI_DIR: R222.1 U28.5(DIR) ; port SPI_MOSI_DIR
SPI_SCK_3V3: CN20.2(SCL) CN28.5 U26.7(B1) U46.1(IO1) U46.10(NC4)
uSD_CS: CN28.2 R287.1 U46.4(IO3) U46.7(NC2) ; port SPI.uSD_CS
uSD_Detect: CN28.10(SW1) U52.1(IO1) ; port uSD_Detect
NetC129_1: C129.1 C132.2 CN24.5(BL_VDD) CN24.6(BL_Control) L6.2
NetC129_2: C129.2 C132.1 CN24.7(BL_GND) CN24.8(BL_GND) L7.2
NetCN20_1: CN20.1(~{CS}) R216.2 R219.1
NetCN20_3: CN20.3(SDI) R220.2
NetCN20_7: CN20.7(SDO) R231.2
NetCN20_8: CN20.8(~{RESET}) Q1.3(D) R226.2
NetL6_1: L6.1 SB45.2 SB46.2
NetQ1_2: Q1.2(S) ; port NRESET

Not connected (* = marked no-connect by the designer): CN20 4(RS)* 5(~{WR})* 6(~{RD})*; CN28 1* 8*; U26 6(B2)*

### Notes on the sheet
- LCD & MICRO SD Card
- (near R287) PB14
- Open drain pin!
- (near R287) PF8
- uSD
- MCU_1V8/3V3
- (near R222) PB15
- (near R222) MFX13
- (near U52) MFX5
- PF9
- PC9
- (near Q1) Open drain pin!
- LCD and MircoSD
- LCD_SIG
- LCD_PWR
- Title:
- Project:
- Size:
- Revision:
- Variant:
- A4
- -
- Date:
- Reference:
- Sheet:
- of
- (in symbol MCD-01174) CN_A
- (in symbol MCD-01195) CN_B

### Library data of the parts
C64 C65 C69 C70 = MCD-00211: Capacitor, MLCC, 100nF, 16V, X7R, 10%, 0603, T=0,8mm; Manufacturer_Part_Number: CC0603KRX7R7BB104; Manufacturer: YAGEO; Provided_By: SUBCO; Initial_Board_Reference: MB1319; Path: ws/MCD_ApplicationBoards/Lists/MCDPARTSdatabase; Item Type: Item; Internal_Part_Number: MCD-00211; ComponentLink1Description: Datasheet; Status: Released; Part_Type: Capacitor; Package: C0603; ComponentLink1URL: http://tunmcdsvn.tun.st.com/Component_Datasheet_Library/Trunk/Capacitors/Yageo_Multilayer_Capacitor_X7R_series_100pF_to_22uF
C129 = MCD-00014: Capacitor, MLCC, 10uF, 25V, X5R, 10%, 0805, T=0,85mm; Manufacturer_Part_Number: CC0805KRX5R8BB106; Manufacturer: YAGEO; Provided_By: SUBCO; Initial_Board_Reference: MB1274; Path: ws/MCD_ApplicationBoards/Lists/MCDPARTSdatabase; Item Type: Item; Internal_Part_Number: MCD-00014; Status: Released; Part_Type: Capacitor; Package: C0805; ComponentLink1Description: Datasheet; ComponentLink1URL: http://tunmcdsvn.tun.st.com/Component_Datasheet_Library/Trunk/Capacitors/Yageo_Multilayer_capacitor_X5R_series_100pF_to_100uF
C132 C186 = MCD-00006: as C93 on sheet Audio; Internal_Part_Number: MCD-00006; Status: Released; Part_Type: Capacitor; Package: C0402; ComponentLink1Description: Datasheet; ComponentLink1URL: http://tunmcdsvn.tun.st.com/Component_Datasheet_Library/Trunk/Capacitors/Yageo_Multilayer_Capacitor_X7R_series_100pF_to_22uF
CN20 = MCD-01174: Socket, 4x2, 2.54mm, VR, TH, Height 6.8mm, Double row; Part_Type: Connector; Manufacturer: LYCN; Provided_By: SUBCO; Initial_Board_Reference: MB1397; Path: ws/MCD_ApplicationBoards/Lists/MCDPARTSdatabase; Item Type: Item; Internal_Part_Number: MCD-01174; Status: Checked; Manufacturer_Part_Number: 216208S141; ComponentLink1Description: Datasheet; ComponentLink1URL: http://tunmcdsvn.tun.st.com/Component_Datasheet_Library/Trunk/Connectors/LYCN_216208S141
CN24 = MCD-01195: socket, 4x2, 2.54mm, VR, TH, Height 6.8mm, Double row; Part_Type: Connector; Manufacturer: LYCN; Provided_By: SUBCO; Initial_Board_Reference: MB1397; Remark: same footprint as MCD-01174; Path: ws/MCD_ApplicationBoards/Lists/MCDPARTSdatabase; Item Type: Item; Internal_Part_Number: MCD-01195; Status: Checked; Manufacturer_Part_Number: 216208S141; ComponentLink1Description: Datasheet; ComponentLink1URL: http://tunmcdsvn.tun.st.com/Component_Datasheet_Library/Trunk/Connectors/LYCN_216208S141
CN28 = MCD-00023: MicroSD Card Conn, Reversed-Type, Mnt Push-Push, Positionning holes; Manufacturer: YAMAICHI; Part_Type: Connector; Provided_By: SUBCO; Initial_Board_Reference: MB1274; Path: ws/MCD_ApplicationBoards/Lists/MCDPARTSdatabase; Item Type: Item; Internal_Part_Number: MCD-00023; Manufacturer_Part_Number: PJS008-2003-1; ComponentLink1Description: Datasheet; Status: Released; ComponentLink1URL: http://tunmcdsvn.tun.st.com/Component_Datasheet_Library/Trunk/Connectors/Yamaichi_Connector_microSD-Card-PJS008-2003
L6 L7 = MCD-00047: SMD Chip ferrite bead, 600R@100MHz +/-25%, 350mA, 500mohm DC, 0603, T=0.8mm; Part_Type: Inductor; Manufacturer_Part_Number: FCM1608KF-601T03; Manufacturer: TAI-TECH; Provided_By: SUBCO; Initial_Board_Reference: MB1274; Path: ws/MCD_ApplicationBoards/Lists/MCDPARTSdatabase; Item Type: Item; Internal_Part_Number: MCD-00047; Status: Released; ComponentLink1Description: Datasheet; ComponentLink1URL: http://tunmcdsvn.tun.st.com/Component_Datasheet_Library/Trunk/Inductors/TaiTech_Bead_FCM1608_series
Q1 = MCD-00151: N-channel enhancement mode field-effect transistor; Part_Type: IC; Manufacturer: NXP; Provided_By: SUBCO; Initial_Board_Reference: MB1262; Path: ws/MCD_ApplicationBoards/Lists/MCDPARTSdatabase; Item Type: Item; Internal_Part_Number: MCD-00151; Value: BSN20; Status: Released; Manufacturer_Part_Number: BSN20; ComponentLink1Description: Datasheet; ComponentLink1URL: http://tunmcdsvn.tun.st.com/Component_Datasheet_Library/Trunk/IC/NXP_Transistor_BSN20BK_SOT23
R216 = MCD-00056: as R257 on sheet Audio; Internal_Part_Number: MCD-00056; Status: Released; Part_Type: Resistor; Package: R0603; ComponentLink1Description: Datasheet; ComponentLink1URL: http://tunmcdsvn.tun.st.com/Component_Datasheet_Library/Trunk/Resistors/Yageo_Resistor_RC0603-series
R218 R222 R233 R287 = MCD-00223: Resistor,100K,0603,1%,1/10W; Manufacturer_Part_Number: RC0603FR-07100KL; Manufacturer: YAGEO; Provided_By: SUBCO; Initial_Board_Reference: MB1319; Path: ws/MCD_ApplicationBoards/Lists/MCDPARTSdatabase; Item Type: Item; Internal_Part_Number: MCD-00223; Status: Released; Part_Type: Resistor; Package: R0603; ComponentLink1Description: Datasheet; ComponentLink1URL: http://tunmcdsvn.tun.st.com/Component_Datasheet_Library/Trunk/Resistors/Yageo_Resistor_RC0603-series
R219 = MCD-00220: Resistor,10K,0603,1%,1/10W; Manufacturer_Part_Number: RC0603FR-0710KL; Manufacturer: YAGEO; Provided_By: SUBCO; Initial_Board_Reference: MB1319; Path: ws/MCD_ApplicationBoards/Lists/MCDPARTSdatabase; Item Type: Item; Internal_Part_Number: MCD-00220; Status: Released; Part_Type: Resistor; Package: R0603; ComponentLink1Description: Datasheet; ComponentLink1URL: http://tunmcdsvn.tun.st.com/Component_Datasheet_Library/Trunk/Resistors/Yageo_Resistor_RC0603-series
R220 R231 = MCD-00442: Resistor,270R,0603,1%,1/10W; Manufacturer_Part_Number: RC0603FR-07270RL; Manufacturer: YAGEO; Provided_By: SUBCO; Initial_Board_Reference: MBxxxx; Path: ws/MCD_ApplicationBoards/Lists/MCDPARTSdatabase; Item Type: Item; Internal_Part_Number: MCD-00442; Status: Released; Part_Type: Resistor; Package: R0603; ComponentLink1Description: Datasheet; ComponentLink1URL: http://tunmcdsvn.tun.st.com/Component_Datasheet_Library/Trunk/Resistors/Yageo_Resistor_RC0603-series
R226 = MCD-00065: as R237 on sheet Audio; Internal_Part_Number: MCD-00065; Status: Released; Part_Type: Resistor; Package: R0402; ComponentLink1Description: Datasheet; ComponentLink1URL: http://tunmcdsvn.tun.st.com/Component_Datasheet_Library/Trunk/Resistors/Yageo_Resistor_RC0402-series; Alternate_Manufacturer: YAGEO
SB45 = MCD-00072: as SB36 on sheet QSPI Memory; Internal_Part_Number: MCD-00072; Status: Released; ComponentLink1Description: Datasheet; Package: SB0603; ComponentLink1URL: http://tunmcdsvn.tun.st.com/Component_Datasheet_Library/Trunk/Resistors/Yageo_Resistor_RC0603-series
SB46 = MCD-00071: as SB35 on sheet QSPI Memory; Internal_Part_Number: MCD-00071; Status: Released; ComponentLink1Description: Datasheet; Package: SB0603; ComponentLink1URL: http://tunmcdsvn.tun.st.com/Component_Datasheet_Library/Trunk/Resistors/Yageo_Resistor_RC0603-series
U26 U28 = MCD-00264: Dual bit dual supply bus transceiver; Part_Type: IC; Manufacturer: TEXAS INSTRUMENTS; Provided_By: SUBCO; Initial_Board_Reference: MB1319; Path: ws/MCD_ApplicationBoards/Lists/MCDPARTSdatabase; Item Type: Item; Internal_Part_Number: MCD-00264; Value: SN74LVC2T45DCUT; Status: Released; Manufacturer_Part_Number: SN74LVC2T45DCUT; ComponentLink1Description: Datasheet; ComponentLink1URL: http://tunmcdsvn.tun.st.com/Component_Datasheet_Library/Trunk/IC/TI_Dual_bit_tranceiver_SN74LVC2T45
U46 = MCD-00667: 4-line ESD protection for high speed lines; Manufacturer: STMICROELECTRONICS; Part_Type: Diode; BMS_Part_Number: 9179041; Provided_By: SUBCO with ST control; Initial_Board_Reference: MB1331; Path: ws/MCD_ApplicationBoards/Lists/MCDPARTSdatabase; Item Type: Item; Manufacturer_Part_Number: HSP051-4M10; Internal_Part_Number: MCD-00667; Value: HSP051-4M10; Status: Checked; Package: uQFN-10L; ComponentLink1Description: Datasheet; ComponentLink1URL: http://tunmcdsvn.tun.st.com/Component_Datasheet_Library/Trunk/Diodes/STM_ESD_HSP051-4M10
U52 = MCD-00170: ESD protection 6V1; Part_Type: Diode; Manufacturer: STMICROELECTRONICS; BMS_Part_Number: 9151132; Provided_By: SUBCO with ST control; Initial_Board_Reference: MB1274; Path: ws/MCD_ApplicationBoards/Lists/MCDPARTSdatabase; Item Type: Item; Internal_Part_Number: MCD-00170; Status: Released; Manufacturer_Part_Number: ESDALC6V1-1U2; ComponentLink1Description: Datasheet; ComponentLink1URL: http://tunmcdsvn.tun.st.com/Component_Datasheet_Library/Trunk/Diodes/STM_ESD_ESDALC6V1-1U2